# Altium project 50ohm-diff_converter.PrjPcb (part 2 of 2)
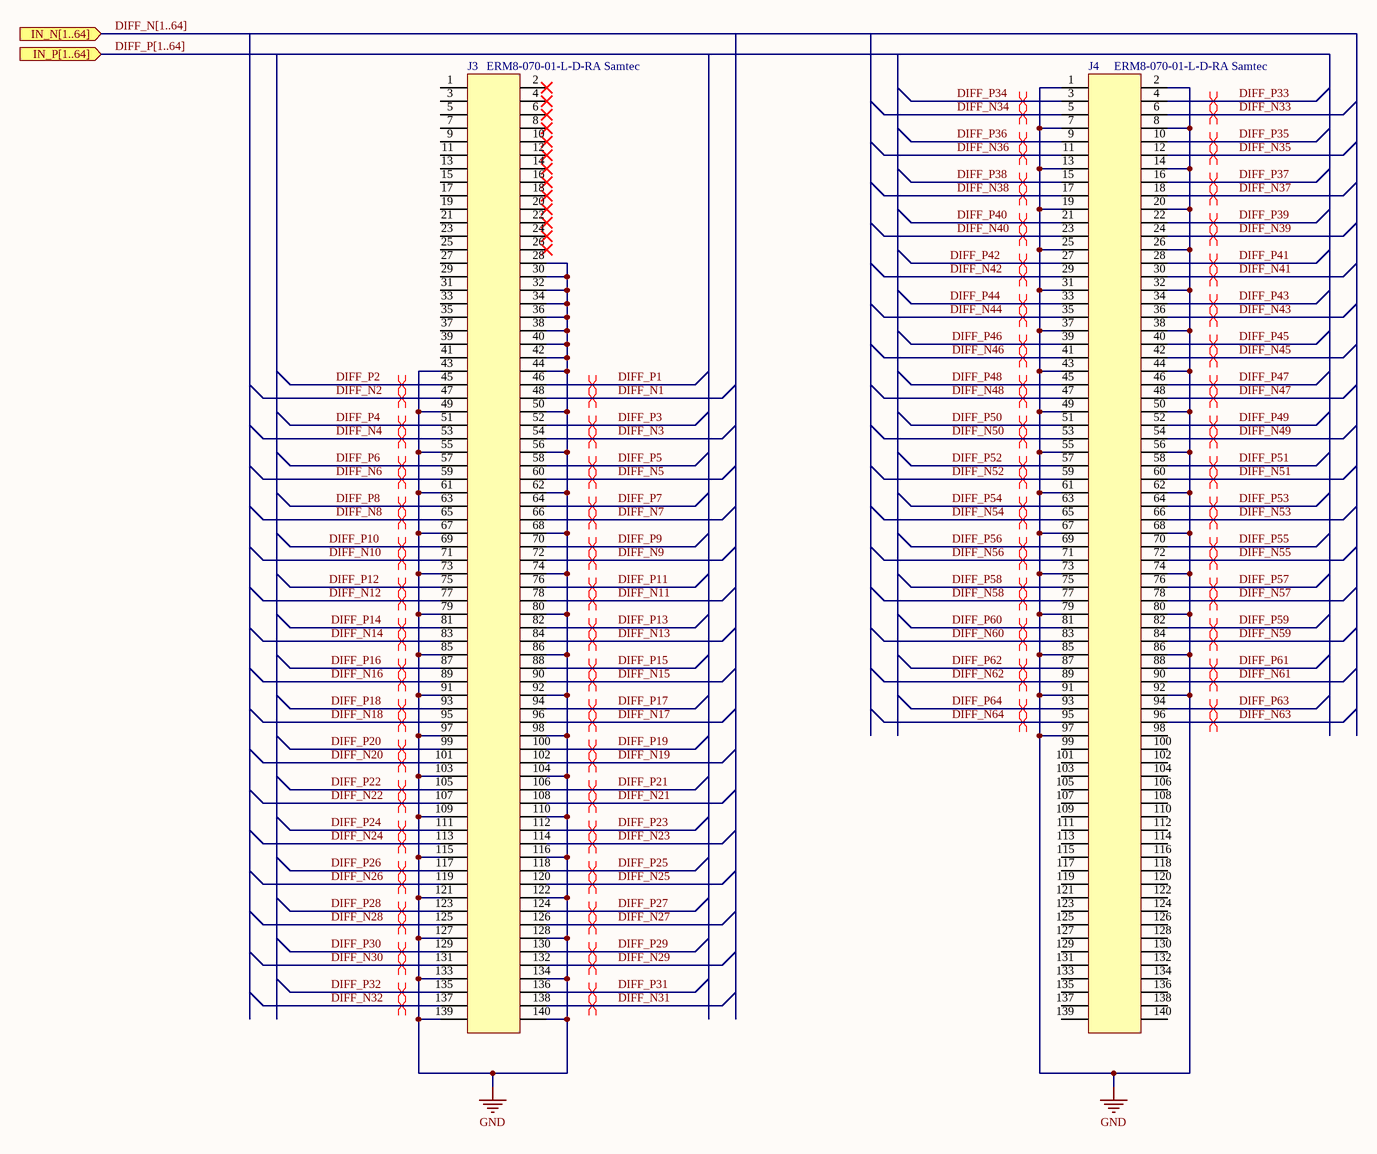
[diagram p4: Output_block.SchDoc]

## Nets that join several sheets
GND: Bank (48 pins), CH1 (C1_CH1.1 C29_CH1.1 U1_CH1.6), CH2 (C1_CH2.1 C29_CH2.1 U1_CH2.6), CH3 (C1_CH3.1 C29_CH3.1 U1_CH3.6), CH4 (C1_CH4.1 C29_CH4.1 U1_CH4.6), CH5 (C1_CH5.1 C29_CH5.1 U1_CH5.6), CH6 (C1_CH6.1 C29_CH6.1 U1_CH6.6), CH7 (C1_CH7.1 C29_CH7.1 U1_CH7.6), CH8 (C1_CH8.1 C29_CH8.1 U1_CH8.6), CH9 (C1_CH9.1 C29_CH9.1 U1_CH9.6), CH10 (C1_CH10.1 C29_CH10.1 U1_CH10.6), CH11 (C1_CH11.1 C29_CH11.1 U1_CH11.6), CH12 (C1_CH12.1 C29_CH12.1 U1_CH12.6), CH13 (C1_CH13.1 C29_CH13.1 U1_CH13.6), CH14 (C1_CH14.1 C29_CH14.1 U1_CH14.6), CH15 (C1_CH15.1 C29_CH15.1 U1_CH15.6), CH16 (C1_CH16.1 C29_CH16.1 U1_CH16.6), Input_block (34 pins), CH17 (C1_CH17.1 C29_CH17.1 U1_CH17.6), CH18 (C1_CH18.1 C29_CH18.1 U1_CH18.6), CH19 (C1_CH19.1 C29_CH19.1 U1_CH19.6), CH20 (C1_CH20.1 C29_CH20.1 U1_CH20.6), CH21 (C1_CH21.1 C29_CH21.1 U1_CH21.6), CH22 (C1_CH22.1 C29_CH22.1 U1_CH22.6), CH23 (C1_CH23.1 C29_CH23.1 U1_CH23.6), CH24 (C1_CH24.1 C29_CH24.1 U1_CH24.6), CH25 (C1_CH25.1 C29_CH25.1 U1_CH25.6), CH26 (C1_CH26.1 C29_CH26.1 U1_CH26.6), CH27 (C1_CH27.1 C29_CH27.1 U1_CH27.6), CH28 (C1_CH28.1 C29_CH28.1 U1_CH28.6), CH29 (C1_CH29.1 C29_CH29.1 U1_CH29.6), CH30 (C1_CH30.1 C29_CH30.1 U1_CH30.6), CH31 (C1_CH31.1 C29_CH31.1 U1_CH31.6), CH32 (C1_CH32.1 C29_CH32.1 U1_CH32.6), Output_block (75 pins), CH33 (C1_CH33.1 C29_CH33.1 U1_CH33.6), CH34 (C1_CH34.1 C29_CH34.1 U1_CH34.6), CH35 (C1_CH35.1 C29_CH35.1 U1_CH35.6), CH36 (C1_CH36.1 C29_CH36.1 U1_CH36.6), CH37 (C1_CH37.1 C29_CH37.1 U1_CH37.6), CH38 (C1_CH38.1 C29_CH38.1 U1_CH38.6), CH39 (C1_CH39.1 C29_CH39.1 U1_CH39.6), CH40 (C1_CH40.1 C29_CH40.1 U1_CH40.6), CH41 (C1_CH41.1 C29_CH41.1 U1_CH41.6), CH42 (C1_CH42.1 C29_CH42.1 U1_CH42.6), CH43 (C1_CH43.1 C29_CH43.1 U1_CH43.6), CH44 (C1_CH44.1 C29_CH44.1 U1_CH44.6), CH45 (C1_CH45.1 C29_CH45.1 U1_CH45.6), CH46 (C1_CH46.1 C29_CH46.1 U1_CH46.6), CH47 (C1_CH47.1 C29_CH47.1 U1_CH47.6), CH48 (C1_CH48.1 C29_CH48.1 U1_CH48.6), CH49 (C1_CH49.1 C29_CH49.1 U1_CH49.6), CH50 (C1_CH50.1 C29_CH50.1 U1_CH50.6), CH51 (C1_CH51.1 C29_CH51.1 U1_CH51.6), CH52 (C1_CH52.1 C29_CH52.1 U1_CH52.6), CH53 (C1_CH53.1 C29_CH53.1 U1_CH53.6), CH54 (C1_CH54.1 C29_CH54.1 U1_CH54.6), CH55 (C1_CH55.1 C29_CH55.1 U1_CH55.6), CH56 (C1_CH56.1 C29_CH56.1 U1_CH56.6), CH57 (C1_CH57.1 C29_CH57.1 U1_CH57.6), CH58 (C1_CH58.1 C29_CH58.1 U1_CH58.6), CH59 (C1_CH59.1 C29_CH59.1 U1_CH59.6), CH60 (C1_CH60.1 C29_CH60.1 U1_CH60.6), CH61 (C1_CH61.1 C29_CH61.1 U1_CH61.6), CH62 (C1_CH62.1 C29_CH62.1 U1_CH62.6), CH63 (C1_CH63.1 C29_CH63.1 U1_CH63.6), CH64 (C1_CH64.1 C29_CH64.1 U1_CH64.6)
DIFF_N1: CH1 (R1_CH1.2 TP4_CH1.1 U1_CH1.5), Output_block (J3.48)
DIFF_N2: CH2 (R1_CH2.2 TP4_CH2.1 U1_CH2.5), Output_block (J3.47)
DIFF_N3: CH3 (R1_CH3.2 TP4_CH3.1 U1_CH3.5), Output_block (J3.54)
DIFF_N4: CH4 (R1_CH4.2 TP4_CH4.1 U1_CH4.5), Output_block (J3.53)
DIFF_N5: CH5 (R1_CH5.2 TP4_CH5.1 U1_CH5.5), Output_block (J3.60)
DIFF_N6: CH6 (R1_CH6.2 TP4_CH6.1 U1_CH6.5), Output_block (J3.59)
DIFF_N7: CH7 (R1_CH7.2 TP4_CH7.1 U1_CH7.5), Output_block (J3.66)
DIFF_N8: CH8 (R1_CH8.2 TP4_CH8.1 U1_CH8.5), Output_block (J3.65)
DIFF_N9: CH9 (R1_CH9.2 TP4_CH9.1 U1_CH9.5), Output_block (J3.72)
DIFF_N10: CH10 (R1_CH10.2 TP4_CH10.1 U1_CH10.5), Output_block (J3.71)
DIFF_N11: CH11 (R1_CH11.2 TP4_CH11.1 U1_CH11.5), Output_block (J3.78)
DIFF_N12: CH12 (R1_CH12.2 TP4_CH12.1 U1_CH12.5), Output_block (J3.77)
DIFF_N13: CH13 (R1_CH13.2 TP4_CH13.1 U1_CH13.5), Output_block (J3.84)
DIFF_N14: CH14 (R1_CH14.2 TP4_CH14.1 U1_CH14.5), Output_block (J3.83)
DIFF_N15: CH15 (R1_CH15.2 TP4_CH15.1 U1_CH15.5), Output_block (J3.90)
DIFF_N16: CH16 (R1_CH16.2 TP4_CH16.1 U1_CH16.5), Output_block (J3.89)
DIFF_N17: CH17 (R1_CH17.2 TP4_CH17.1 U1_CH17.5), Output_block (J3.96)
DIFF_N18: CH18 (R1_CH18.2 TP4_CH18.1 U1_CH18.5), Output_block (J3.95)
DIFF_N19: CH19 (R1_CH19.2 TP4_CH19.1 U1_CH19.5), Output_block (J3.102)
DIFF_N20: CH20 (R1_CH20.2 TP4_CH20.1 U1_CH20.5), Output_block (J3.101)
DIFF_N21: CH21 (R1_CH21.2 TP4_CH21.1 U1_CH21.5), Output_block (J3.108)
DIFF_N22: CH22 (R1_CH22.2 TP4_CH22.1 U1_CH22.5), Output_block (J3.107)
DIFF_N23: CH23 (R1_CH23.2 TP4_CH23.1 U1_CH23.5), Output_block (J3.114)
DIFF_N24: CH24 (R1_CH24.2 TP4_CH24.1 U1_CH24.5), Output_block (J3.113)
DIFF_N25: CH25 (R1_CH25.2 TP4_CH25.1 U1_CH25.5), Output_block (J3.120)
DIFF_N26: CH26 (R1_CH26.2 TP4_CH26.1 U1_CH26.5), Output_block (J3.119)
DIFF_N27: CH27 (R1_CH27.2 TP4_CH27.1 U1_CH27.5), Output_block (J3.126)
DIFF_N28: CH28 (R1_CH28.2 TP4_CH28.1 U1_CH28.5), Output_block (J3.125)
DIFF_N29: CH29 (R1_CH29.2 TP4_CH29.1 U1_CH29.5), Output_block (J3.132)
DIFF_N30: CH30 (R1_CH30.2 TP4_CH30.1 U1_CH30.5), Output_block (J3.131)
DIFF_N31: CH31 (R1_CH31.2 TP4_CH31.1 U1_CH31.5), Output_block (J3.138)
DIFF_N32: CH32 (R1_CH32.2 TP4_CH32.1 U1_CH32.5), Output_block (J3.137)
DIFF_N33: Output_block (J4.6), CH33 (R1_CH33.2 TP4_CH33.1 U1_CH33.5)
DIFF_N34: Output_block (J4.5), CH34 (R1_CH34.2 TP4_CH34.1 U1_CH34.5)
DIFF_N35: Output_block (J4.12), CH35 (R1_CH35.2 TP4_CH35.1 U1_CH35.5)
DIFF_N36: Output_block (J4.11), CH36 (R1_CH36.2 TP4_CH36.1 U1_CH36.5)
DIFF_N37: Output_block (J4.18), CH37 (R1_CH37.2 TP4_CH37.1 U1_CH37.5)
DIFF_N38: Output_block (J4.17), CH38 (R1_CH38.2 TP4_CH38.1 U1_CH38.5)
DIFF_N39: Output_block (J4.24), CH39 (R1_CH39.2 TP4_CH39.1 U1_CH39.5)
DIFF_N40: Output_block (J4.23), CH40 (R1_CH40.2 TP4_CH40.1 U1_CH40.5)
DIFF_N41: Output_block (J4.30), CH41 (R1_CH41.2 TP4_CH41.1 U1_CH41.5)
DIFF_N42: Output_block (J4.29), CH42 (R1_CH42.2 TP4_CH42.1 U1_CH42.5)
DIFF_N43: Output_block (J4.36), CH43 (R1_CH43.2 TP4_CH43.1 U1_CH43.5)
DIFF_N44: Output_block (J4.35), CH44 (R1_CH44.2 TP4_CH44.1 U1_CH44.5)
DIFF_N45: Output_block (J4.42), CH45 (R1_CH45.2 TP4_CH45.1 U1_CH45.5)
DIFF_N46: Output_block (J4.41), CH46 (R1_CH46.2 TP4_CH46.1 U1_CH46.5)
DIFF_N47: Output_block (J4.48), CH47 (R1_CH47.2 TP4_CH47.1 U1_CH47.5)
DIFF_N48: Output_block (J4.47), CH48 (R1_CH48.2 TP4_CH48.1 U1_CH48.5)
DIFF_N49: Output_block (J4.54), CH49 (R1_CH49.2 TP4_CH49.1 U1_CH49.5)
DIFF_N50: Output_block (J4.53), CH50 (R1_CH50.2 TP4_CH50.1 U1_CH50.5)
DIFF_N51: Output_block (J4.60), CH51 (R1_CH51.2 TP4_CH51.1 U1_CH51.5)
DIFF_N52: Output_block (J4.59), CH52 (R1_CH52.2 TP4_CH52.1 U1_CH52.5)
DIFF_N53: Output_block (J4.66), CH53 (R1_CH53.2 TP4_CH53.1 U1_CH53.5)
DIFF_N54: Output_block (J4.65), CH54 (R1_CH54.2 TP4_CH54.1 U1_CH54.5)
DIFF_N55: Output_block (J4.72), CH55 (R1_CH55.2 TP4_CH55.1 U1_CH55.5)
DIFF_N56: Output_block (J4.71), CH56 (R1_CH56.2 TP4_CH56.1 U1_CH56.5)
DIFF_N57: Output_block (J4.78), CH57 (R1_CH57.2 TP4_CH57.1 U1_CH57.5)
DIFF_N58: Output_block (J4.77), CH58 (R1_CH58.2 TP4_CH58.1 U1_CH58.5)
DIFF_N59: Output_block (J4.84), CH59 (R1_CH59.2 TP4_CH59.1 U1_CH59.5)
DIFF_N60: Output_block (J4.83), CH60 (R1_CH60.2 TP4_CH60.1 U1_CH60.5)
DIFF_N61: Output_block (J4.90), CH61 (R1_CH61.2 TP4_CH61.1 U1_CH61.5)
DIFF_N62: Output_block (J4.89), CH62 (R1_CH62.2 TP4_CH62.1 U1_CH62.5)
DIFF_N63: Output_block (J4.96), CH63 (R1_CH63.2 TP4_CH63.1 U1_CH63.5)
DIFF_N64: Output_block (J4.95), CH64 (R1_CH64.2 TP4_CH64.1 U1_CH64.5)
DIFF_P1: CH1 (R8_CH1.2 TP5_CH1.1 U1_CH1.4), Output_block (J3.46)
DIFF_P2: CH2 (R8_CH2.2 TP5_CH2.1 U1_CH2.4), Output_block (J3.45)
DIFF_P3: CH3 (R8_CH3.2 TP5_CH3.1 U1_CH3.4), Output_block (J3.52)
DIFF_P4: CH4 (R8_CH4.2 TP5_CH4.1 U1_CH4.4), Output_block (J3.51)
DIFF_P5: CH5 (R8_CH5.2 TP5_CH5.1 U1_CH5.4), Output_block (J3.58)
DIFF_P6: CH6 (R8_CH6.2 TP5_CH6.1 U1_CH6.4), Output_block (J3.57)
DIFF_P7: CH7 (R8_CH7.2 TP5_CH7.1 U1_CH7.4), Output_block (J3.64)
DIFF_P8: CH8 (R8_CH8.2 TP5_CH8.1 U1_CH8.4), Output_block (J3.63)
DIFF_P9: CH9 (R8_CH9.2 TP5_CH9.1 U1_CH9.4), Output_block (J3.70)
DIFF_P10: CH10 (R8_CH10.2 TP5_CH10.1 U1_CH10.4), Output_block (J3.69)
DIFF_P11: CH11 (R8_CH11.2 TP5_CH11.1 U1_CH11.4), Output_block (J3.76)
DIFF_P12: CH12 (R8_CH12.2 TP5_CH12.1 U1_CH12.4), Output_block (J3.75)
DIFF_P13: CH13 (R8_CH13.2 TP5_CH13.1 U1_CH13.4), Output_block (J3.82)
DIFF_P14: CH14 (R8_CH14.2 TP5_CH14.1 U1_CH14.4), Output_block (J3.81)
DIFF_P15: CH15 (R8_CH15.2 TP5_CH15.1 U1_CH15.4), Output_block (J3.88)
DIFF_P16: CH16 (R8_CH16.2 TP5_CH16.1 U1_CH16.4), Output_block (J3.87)
DIFF_P17: CH17 (R8_CH17.2 TP5_CH17.1 U1_CH17.4), Output_block (J3.94)
DIFF_P18: CH18 (R8_CH18.2 TP5_CH18.1 U1_CH18.4), Output_block (J3.93)
DIFF_P19: CH19 (R8_CH19.2 TP5_CH19.1 U1_CH19.4), Output_block (J3.100)
DIFF_P20: CH20 (R8_CH20.2 TP5_CH20.1 U1_CH20.4), Output_block (J3.99)
DIFF_P21: CH21 (R8_CH21.2 TP5_CH21.1 U1_CH21.4), Output_block (J3.106)
DIFF_P22: CH22 (R8_CH22.2 TP5_CH22.1 U1_CH22.4), Output_block (J3.105)
DIFF_P23: CH23 (R8_CH23.2 TP5_CH23.1 U1_CH23.4), Output_block (J3.112)
DIFF_P24: CH24 (R8_CH24.2 TP5_CH24.1 U1_CH24.4), Output_block (J3.111)
DIFF_P25: CH25 (R8_CH25.2 TP5_CH25.1 U1_CH25.4), Output_block (J3.118)
DIFF_P26: CH26 (R8_CH26.2 TP5_CH26.1 U1_CH26.4), Output_block (J3.117)
DIFF_P27: CH27 (R8_CH27.2 TP5_CH27.1 U1_CH27.4), Output_block (J3.124)
DIFF_P28: CH28 (R8_CH28.2 TP5_CH28.1 U1_CH28.4), Output_block (J3.123)
DIFF_P29: CH29 (R8_CH29.2 TP5_CH29.1 U1_CH29.4), Output_block (J3.130)
DIFF_P30: CH30 (R8_CH30.2 TP5_CH30.1 U1_CH30.4), Output_block (J3.129)
DIFF_P31: CH31 (R8_CH31.2 TP5_CH31.1 U1_CH31.4), Output_block (J3.136)
DIFF_P32: CH32 (R8_CH32.2 TP5_CH32.1 U1_CH32.4), Output_block (J3.135)
DIFF_P33: Output_block (J4.4), CH33 (R8_CH33.2 TP5_CH33.1 U1_CH33.4)
DIFF_P34: Output_block (J4.3), CH34 (R8_CH34.2 TP5_CH34.1 U1_CH34.4)
DIFF_P35: Output_block (J4.10), CH35 (R8_CH35.2 TP5_CH35.1 U1_CH35.4)
DIFF_P36: Output_block (J4.9), CH36 (R8_CH36.2 TP5_CH36.1 U1_CH36.4)
DIFF_P37: Output_block (J4.16), CH37 (R8_CH37.2 TP5_CH37.1 U1_CH37.4)
DIFF_P38: Output_block (J4.15), CH38 (R8_CH38.2 TP5_CH38.1 U1_CH38.4)
DIFF_P39: Output_block (J4.22), CH39 (R8_CH39.2 TP5_CH39.1 U1_CH39.4)
DIFF_P40: Output_block (J4.21), CH40 (R8_CH40.2 TP5_CH40.1 U1_CH40.4)
DIFF_P41: Output_block (J4.28), CH41 (R8_CH41.2 TP5_CH41.1 U1_CH41.4)
DIFF_P42: Output_block (J4.27), CH42 (R8_CH42.2 TP5_CH42.1 U1_CH42.4)
DIFF_P43: Output_block (J4.34), CH43 (R8_CH43.2 TP5_CH43.1 U1_CH43.4)
DIFF_P44: Output_block (J4.33), CH44 (R8_CH44.2 TP5_CH44.1 U1_CH44.4)
DIFF_P45: Output_block (J4.40), CH45 (R8_CH45.2 TP5_CH45.1 U1_CH45.4)
DIFF_P46: Output_block (J4.39), CH46 (R8_CH46.2 TP5_CH46.1 U1_CH46.4)
DIFF_P47: Output_block (J4.46), CH47 (R8_CH47.2 TP5_CH47.1 U1_CH47.4)
DIFF_P48: Output_block (J4.45), CH48 (R8_CH48.2 TP5_CH48.1 U1_CH48.4)
DIFF_P49: Output_block (J4.52), CH49 (R8_CH49.2 TP5_CH49.1 U1_CH49.4)
DIFF_P50: Output_block (J4.51), CH50 (R8_CH50.2 TP5_CH50.1 U1_CH50.4)
DIFF_P51: Output_block (J4.58), CH51 (R8_CH51.2 TP5_CH51.1 U1_CH51.4)
DIFF_P52: Output_block (J4.57), CH52 (R8_CH52.2 TP5_CH52.1 U1_CH52.4)
DIFF_P53: Output_block (J4.64), CH53 (R8_CH53.2 TP5_CH53.1 U1_CH53.4)
DIFF_P54: Output_block (J4.63), CH54 (R8_CH54.2 TP5_CH54.1 U1_CH54.4)
DIFF_P55: Output_block (J4.70), CH55 (R8_CH55.2 TP5_CH55.1 U1_CH55.4)
DIFF_P56: Output_block (J4.69), CH56 (R8_CH56.2 TP5_CH56.1 U1_CH56.4)
DIFF_P57: Output_block (J4.76), CH57 (R8_CH57.2 TP5_CH57.1 U1_CH57.4)
DIFF_P58: Output_block (J4.75), CH58 (R8_CH58.2 TP5_CH58.1 U1_CH58.4)
DIFF_P59: Output_block (J4.82), CH59 (R8_CH59.2 TP5_CH59.1 U1_CH59.4)
DIFF_P60: Output_block (J4.81), CH60 (R8_CH60.2 TP5_CH60.1 U1_CH60.4)
DIFF_P61: Output_block (J4.88), CH61 (R8_CH61.2 TP5_CH61.1 U1_CH61.4)
DIFF_P62: Output_block (J4.87), CH62 (R8_CH62.2 TP5_CH62.1 U1_CH62.4)
DIFF_P63: Output_block (J4.94), CH63 (R8_CH63.2 TP5_CH63.1 U1_CH63.4)
DIFF_P64: Output_block (J4.93), CH64 (R8_CH64.2 TP5_CH64.1 U1_CH64.4)
IN1: CH1 (R2_CH1.1), Input_block (J1.a1)
IN2: CH2 (R2_CH2.1), Input_block (J1.a2)
IN3: CH3 (R2_CH3.1), Input_block (J1.a3)
IN4: CH4 (R2_CH4.1), Input_block (J1.a4)
IN5: CH5 (R2_CH5.1), Input_block (J1.a5)
IN6: CH6 (R2_CH6.1), Input_block (J1.a6)
IN7: CH7 (R2_CH7.1), Input_block (J1.a7)
IN8: CH8 (R2_CH8.1), Input_block (J1.a8)
IN9: CH9 (R2_CH9.1), Input_block (J1.a9)
IN10: CH10 (R2_CH10.1), Input_block (J1.a10)
IN11: CH11 (R2_CH11.1), Input_block (J1.a11)
IN12: CH12 (R2_CH12.1), Input_block (J1.a12)
IN13: CH13 (R2_CH13.1), Input_block (J1.a13)
IN14: CH14 (R2_CH14.1), Input_block (J1.a14)
IN15: CH15 (R2_CH15.1), Input_block (J1.a15)
IN16: CH16 (R2_CH16.1), Input_block (J1.a16)
IN17: Input_block (J1.a17), CH17 (R2_CH17.1)
IN18: Input_block (J1.a18), CH18 (R2_CH18.1)
IN19: Input_block (J1.a19), CH19 (R2_CH19.1)
IN20: Input_block (J1.a20), CH20 (R2_CH20.1)
IN21: Input_block (J1.a21), CH21 (R2_CH21.1)
IN22: Input_block (J1.a22), CH22 (R2_CH22.1)
IN23: Input_block (J1.a23), CH23 (R2_CH23.1)
IN24: Input_block (J1.a24), CH24 (R2_CH24.1)
IN25: Input_block (J1.a25), CH25 (R2_CH25.1)
IN26: Input_block (J1.a26), CH26 (R2_CH26.1)
IN27: Input_block (J1.a27), CH27 (R2_CH27.1)
IN28: Input_block (J1.a28), CH28 (R2_CH28.1)
IN29: Input_block (J1.a29), CH29 (R2_CH29.1)
IN30: Input_block (J1.a30), CH30 (R2_CH30.1)
IN31: Input_block (J1.a31), CH31 (R2_CH31.1)
IN32: Input_block (J1.a32), CH32 (R2_CH32.1)
IN33: Input_block (J1.c1), CH33 (R2_CH33.1)
IN34: Input_block (J1.c2), CH34 (R2_CH34.1)
IN35: Input_block (J1.c3), CH35 (R2_CH35.1)
IN36: Input_block (J1.c4), CH36 (R2_CH36.1)
IN37: Input_block (J1.c5), CH37 (R2_CH37.1)
IN38: Input_block (J1.c6), CH38 (R2_CH38.1)
IN39: Input_block (J1.c7), CH39 (R2_CH39.1)
IN40: Input_block (J1.c8), CH40 (R2_CH40.1)
IN41: Input_block (J1.c9), CH41 (R2_CH41.1)
IN42: Input_block (J1.c10), CH42 (R2_CH42.1)
IN43: Input_block (J1.c11), CH43 (R2_CH43.1)
IN44: Input_block (J1.c12), CH44 (R2_CH44.1)
IN45: Input_block (J1.c13), CH45 (R2_CH45.1)
IN46: Input_block (J1.c14), CH46 (R2_CH46.1)
IN47: Input_block (J1.c15), CH47 (R2_CH47.1)
IN48: Input_block (J1.c16), CH48 (R2_CH48.1)
IN49: Input_block (J1.c17), CH49 (R2_CH49.1)
IN50: Input_block (J1.c18), CH50 (R2_CH50.1)
IN51: Input_block (J1.c19), CH51 (R2_CH51.1)
IN52: Input_block (J1.c20), CH52 (R2_CH52.1)
IN53: Input_block (J1.c21), CH53 (R2_CH53.1)
IN54: Input_block (J1.c22), CH54 (R2_CH54.1)
IN55: Input_block (J1.c23), CH55 (R2_CH55.1)
IN56: Input_block (J1.c24), CH56 (R2_CH56.1)
IN57: Input_block (J1.c25), CH57 (R2_CH57.1)
IN58: Input_block (J1.c26), CH58 (R2_CH58.1)
IN59: Input_block (J1.c27), CH59 (R2_CH59.1)
IN60: Input_block (J1.c28), CH60 (R2_CH60.1)
IN61: Input_block (J1.c29), CH61 (R2_CH61.1)
IN62: Input_block (J1.c30), CH62 (R2_CH62.1)
IN63: Input_block (J1.c31), CH63 (R2_CH63.1)
IN64: Input_block (J1.c32), CH64 (R2_CH64.1)
VOCM: Bank (7 pins), CH1 (U1_CH1.2), CH2 (U1_CH2.2), CH3 (U1_CH3.2), CH4 (U1_CH4.2), CH5 (U1_CH5.2), CH6 (U1_CH6.2), CH7 (U1_CH7.2), CH8 (U1_CH8.2), CH9 (U1_CH9.2), CH10 (U1_CH10.2), CH11 (U1_CH11.2), CH12 (U1_CH12.2), CH13 (U1_CH13.2), CH14 (U1_CH14.2), CH15 (U1_CH15.2), CH16 (U1_CH16.2), CH17 (U1_CH17.2), CH18 (U1_CH18.2), CH19 (U1_CH19.2), CH20 (U1_CH20.2), CH21 (U1_CH21.2), CH22 (U1_CH22.2), CH23 (U1_CH23.2), CH24 (U1_CH24.2), CH25 (U1_CH25.2), CH26 (U1_CH26.2), CH27 (U1_CH27.2), CH28 (U1_CH28.2), CH29 (U1_CH29.2), CH30 (U1_CH30.2), CH31 (U1_CH31.2), CH32 (U1_CH32.2), CH33 (U1_CH33.2), CH34 (U1_CH34.2), CH35 (U1_CH35.2), CH36 (U1_CH36.2), CH37 (U1_CH37.2), CH38 (U1_CH38.2), CH39 (U1_CH39.2), CH40 (U1_CH40.2), CH41 (U1_CH41.2), CH42 (U1_CH42.2), CH43 (U1_CH43.2), CH44 (U1_CH44.2), CH45 (U1_CH45.2), CH46 (U1_CH46.2), CH47 (U1_CH47.2), CH48 (U1_CH48.2), CH49 (U1_CH49.2), CH50 (U1_CH50.2), CH51 (U1_CH51.2), CH52 (U1_CH52.2), CH53 (U1_CH53.2), CH54 (U1_CH54.2), CH55 (U1_CH55.2), CH56 (U1_CH56.2), CH57 (U1_CH57.2), CH58 (U1_CH58.2), CH59 (U1_CH59.2), CH60 (U1_CH60.2), CH61 (U1_CH61.2), CH62 (U1_CH62.2), CH63 (U1_CH63.2), CH64 (U1_CH64.2)
VOFFS1: Bank (C22.2 U6.1 U6.4), CH1 (C29_CH1.2 R3_CH1.1), CH2 (C29_CH2.2 R3_CH2.1), CH3 (C29_CH3.2 R3_CH3.1), CH4 (C29_CH4.2 R3_CH4.1), CH5 (C29_CH5.2 R3_CH5.1), CH6 (C29_CH6.2 R3_CH6.1), CH7 (C29_CH7.2 R3_CH7.1), CH8 (C29_CH8.2 R3_CH8.1), CH9 (C29_CH9.2 R3_CH9.1), CH10 (C29_CH10.2 R3_CH10.1), CH11 (C29_CH11.2 R3_CH11.1), CH12 (C29_CH12.2 R3_CH12.1), CH13 (C29_CH13.2 R3_CH13.1), CH14 (C29_CH14.2 R3_CH14.1), CH15 (C29_CH15.2 R3_CH15.1), CH16 (C29_CH16.2 R3_CH16.1)
VOFFS2: Bank (C23.2 U7.1 U7.4), CH17 (C29_CH17.2 R3_CH17.1), CH18 (C29_CH18.2 R3_CH18.1), CH19 (C29_CH19.2 R3_CH19.1), CH20 (C29_CH20.2 R3_CH20.1), CH21 (C29_CH21.2 R3_CH21.1), CH22 (C29_CH22.2 R3_CH22.1), CH23 (C29_CH23.2 R3_CH23.1), CH24 (C29_CH24.2 R3_CH24.1), CH25 (C29_CH25.2 R3_CH25.1), CH26 (C29_CH26.2 R3_CH26.1), CH27 (C29_CH27.2 R3_CH27.1), CH28 (C29_CH28.2 R3_CH28.1), CH29 (C29_CH29.2 R3_CH29.1), CH30 (C29_CH30.2 R3_CH30.1), CH31 (C29_CH31.2 R3_CH31.1), CH32 (C29_CH32.2 R3_CH32.1)
VOFFS3: Bank (C24.2 U9.1 U9.4), CH33 (C29_CH33.2 R3_CH33.1), CH34 (C29_CH34.2 R3_CH34.1), CH35 (C29_CH35.2 R3_CH35.1), CH36 (C29_CH36.2 R3_CH36.1), CH37 (C29_CH37.2 R3_CH37.1), CH38 (C29_CH38.2 R3_CH38.1), CH39 (C29_CH39.2 R3_CH39.1), CH40 (C29_CH40.2 R3_CH40.1), CH41 (C29_CH41.2 R3_CH41.1), CH42 (C29_CH42.2 R3_CH42.1), CH43 (C29_CH43.2 R3_CH43.1), CH44 (C29_CH44.2 R3_CH44.1), CH45 (C29_CH45.2 R3_CH45.1), CH46 (C29_CH46.2 R3_CH46.1), CH47 (C29_CH47.2 R3_CH47.1), CH48 (C29_CH48.2 R3_CH48.1)
VOFFS4: Bank (C25.2 U8.1 U8.4), CH49 (C29_CH49.2 R3_CH49.1), CH50 (C29_CH50.2 R3_CH50.1), CH51 (C29_CH51.2 R3_CH51.1), CH52 (C29_CH52.2 R3_CH52.1), CH53 (C29_CH53.2 R3_CH53.1), CH54 (C29_CH54.2 R3_CH54.1), CH55 (C29_CH55.2 R3_CH55.1), CH56 (C29_CH56.2 R3_CH56.1), CH57 (C29_CH57.2 R3_CH57.1), CH58 (C29_CH58.2 R3_CH58.1), CH59 (C29_CH59.2 R3_CH59.1), CH60 (C29_CH60.2 R3_CH60.1), CH61 (C29_CH61.2 R3_CH61.1), CH62 (C29_CH62.2 R3_CH62.1), CH63 (C29_CH63.2 R3_CH63.1), CH64 (C29_CH64.2 R3_CH64.1)
VSUP1: Bank (L2.2 TP1.1 U6.5), CH1 (R7_CH1.1), CH2 (R7_CH2.1), CH3 (R7_CH3.1), CH4 (R7_CH4.1), CH5 (R7_CH5.1), CH6 (R7_CH6.1), CH7 (R7_CH7.1), CH8 (R7_CH8.1), CH9 (R7_CH9.1), CH10 (R7_CH10.1), CH11 (R7_CH11.1), CH12 (R7_CH12.1), CH13 (R7_CH13.1), CH14 (R7_CH14.1), CH15 (R7_CH15.1), CH16 (R7_CH16.1)
VSUP2: Bank (L5.2 TP2.1 U7.5), CH17 (R7_CH17.1), CH18 (R7_CH18.1), CH19 (R7_CH19.1), CH20 (R7_CH20.1), CH21 (R7_CH21.1), CH22 (R7_CH22.1), CH23 (R7_CH23.1), CH24 (R7_CH24.1), CH25 (R7_CH25.1), CH26 (R7_CH26.1), CH27 (R7_CH27.1), CH28 (R7_CH28.1), CH29 (R7_CH29.1), CH30 (R7_CH30.1), CH31 (R7_CH31.1), CH32 (R7_CH32.1)
VSUP3: Bank (7 pins), CH33 (R7_CH33.1), CH34 (R7_CH34.1), CH35 (R7_CH35.1), CH36 (R7_CH36.1), CH37 (R7_CH37.1), CH38 (R7_CH38.1), CH39 (R7_CH39.1), CH40 (R7_CH40.1), CH41 (R7_CH41.1), CH42 (R7_CH42.1), CH43 (R7_CH43.1), CH44 (R7_CH44.1), CH45 (R7_CH45.1), CH46 (R7_CH46.1), CH47 (R7_CH47.1), CH48 (R7_CH48.1)
VSUP4: Bank (L9.2 TP8.1 U8.5), CH49 (R7_CH49.1), CH50 (R7_CH50.1), CH51 (R7_CH51.1), CH52 (R7_CH52.1), CH53 (R7_CH53.1), CH54 (R7_CH54.1), CH55 (R7_CH55.1), CH56 (R7_CH56.1), CH57 (R7_CH57.1), CH58 (R7_CH58.1), CH59 (R7_CH59.1), CH60 (R7_CH60.1), CH61 (R7_CH61.1), CH62 (R7_CH62.1), CH63 (R7_CH63.1), CH64 (R7_CH64.1)